# Altium schematic sheet POWER&USB_USART.SchDoc
size A4
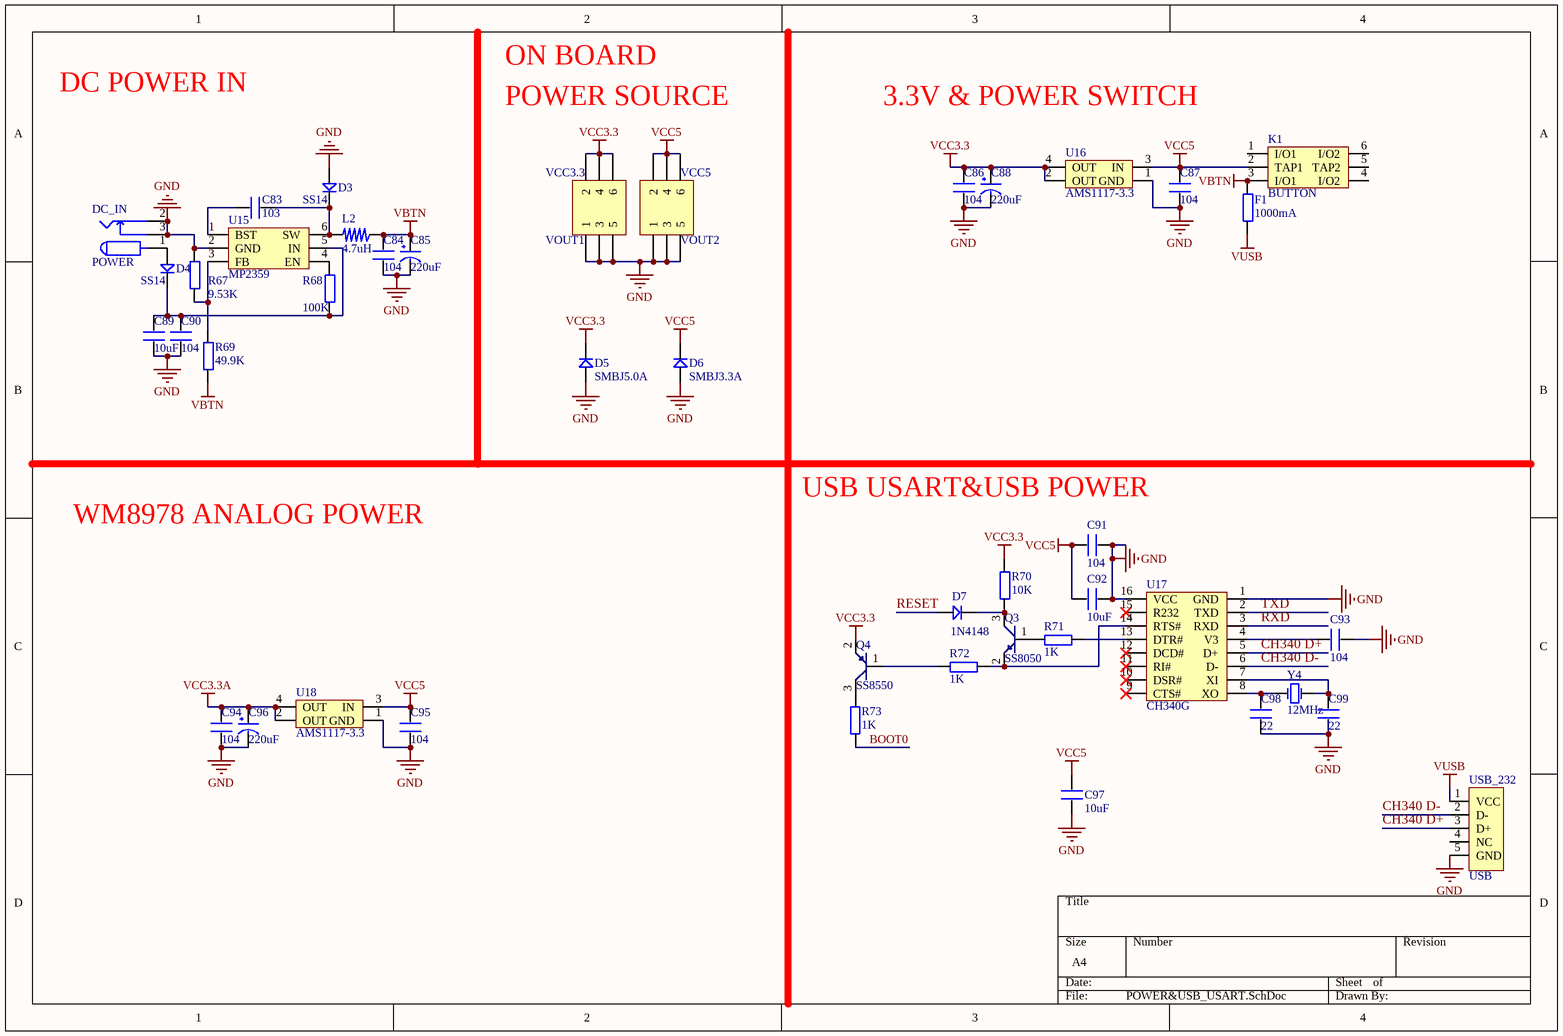
[diagram p0: POWER&USB_USART.SchDoc]

## Parts
C83  103  [R0603]
C84  104  [R0603]
C85  220uF  [CC6.56.5]
C86  104  [R0603]
C87  104  [R0603]
C88  220uF  [CC6.56.5]
C89  10uF  [1206]
C90  104  [R0603]
C91  104  [R0603]
C92  10uF  [1206]
C93  104  [R0603]
C94  104  [R0603]
C95  104  [R0603]
C96  220uF  [CC6.56.5]
C97  10uF  [1206]
C98  22  [R0603]
C99  22  [R0603]
D3  SS14  [DIODE_3*5.3]
D4  SS14  [DIODE_3*5.3]
D5  SMBJ5.0A  [SMBJ]
D6  SMBJ3.3A  [SMBJ]
D7  1N4148  [DIODE_SOP]
DC_IN  POWER  [DC10B]
F1  1000mA  [1206]
K1  BUTTON  [BTN8.5*8.5]
L2  4.7uH  [L_SOP74]
Q3  SS8050  [SOT23-3]
Q4  SS8550  [SOT23-3]
R67  9.53K  [R0603]
R68  100K  [R0603]
R69  49.9K  [R0603]
R70  10K  [R0603]
R71  1K  [R0603]
R72  1K  [R0603]
R73  1K  [R0603]
U15  MP2359  [SOT-23-6]
U16  AMS1117-3.3  [AMS1117]
U17  CH340G  [SOP16M]
U18  AMS1117-3.3  [AMS1117]
USB_232  USB  [MiniUSB/SM0.8-6H5]
VOUT1  VCC3.3  [HDR2X3]
VOUT2  VCC5  [HDR2X3]
Y4  12MHz  [XTAL_US]

## Nets
GND: C84.2 C85.2(GND) C86.2 C87.2 C88.2(GND) C89.2 C90.2 C91.1 C92.1 C93.1 C94.2 C95.2 C96.2(GND) C97.2 C98.1 C99.1 D3.1 D5.1 D6.1 DC_IN.2 DC_IN.3 R67.2 U15.2(GND) U16.1(GND) U17.1(GND) U17.16(VCC) U18.1(GND) USB_232.5(GND) VOUT1.1 VOUT1.3 VOUT1.5 VOUT2.1 VOUT2.3 VOUT2.5
VBTN: C84.1 C85.1(VCC) F1.2 K1.3(I/O1) L2.1 R69.1
VCC3.3: C86.1 C88.1(VCC) D5.2 Q4.2(E) R70.1 U16.2(OUT) U16.4(OUT) VOUT1.2 VOUT1.4 VOUT1.6
VCC3.3A: C94.1 C96.1(VCC) U18.2(OUT) U18.4(OUT)
VCC5: C87.1 C91.2 C92.2 C95.1 C97.1 D6.2 K1.2(TAP1) U16.3(IN) U18.3(IN) VOUT2.2 VOUT2.4 VOUT2.6
VUSB: F1.1 USB_232.1(VCC)
BOOT0: R73.2
CH340 D+: U17.5(D+) USB_232.3(D+)
CH340 D-: U17.6(D-) USB_232.2(D-)
RESET: D7.1
RXD: U17.3(RXD)
TXD: U17.2(TXD)
NetC83_1: C83.1 D3.2 L2.2 U15.6(SW)
NetC83_2: C83.2 U15.1(BST)
NetC89_1: C89.1 C90.1 D4.2 R68.1 U15.5(IN)
NetC93_2: C93.2 U17.4(V3)
NetC98_2: C98.2 U17.8(XO) Y4.2(OSC2)
NetC99_2: C99.2 U17.7(XI) Y4.1(OSC1)
NetD4_1: D4.1 DC_IN.1
NetD7_2: D7.2 Q3.3(C) R70.2
NetQ3_1: Q3.1(B) R71.2
NetQ3_2: Q3.2(E) R72.1 U17.14(RTS#)
NetQ4_1: Q4.1(B) R72.2
NetQ4_3: Q4.3(C) R73.1
NetR67_1: R67.1 R69.2 U15.3(FB)
NetR68_2: R68.2 U15.4(EN)
NetR71_1: R71.1 U17.13(DTR#)

Not connected (* = marked no-connect by the designer): K1 1(I/O1) 4(I/O2) 5(TAP2) 6(I/O2); U17 9(CTS#)* 10(DSR#)* 11(RI#)* 12(DCD#)* 15(R232)*; USB_232 4(NC)

## Notes on the sheet
- DC POWER IN
- ON BOARD
- POWER SOURCE
- 3.3V & POWER SWITCH
- (near C91) USB USART&USB POWER
- WM8978 ANALOG POWER

## Library data of the parts
C83 C84 C86 C87 C89-C95 C97-C99 = C
C85 C88 C96 = CAP
D3-D7 = D
DC_IN = POW
F1 R67-R73 = R
L2 = L_SOP
U15 = MP2359: DC DC Step Down IC
U16 U18 = AMS1117
U17 = CH340G: USB2UART
USB_232 = USB5
VOUT1 VOUT2 = Header 3X2: Header, 3-Pin, Dual row; LatestRevisionDate: 17-Jul-2002; LatestRevisionNote: Re-released for DXP Platform.; Publisher: Altium Limited
Y4 = XTAL_2: Crystal Oscillator; Published: 8-Jun-2000; LatestRevisionDate: 17-Jul-2002; LatestRevisionNote: Re-released for DXP Platform.; Publisher: Altium Limited